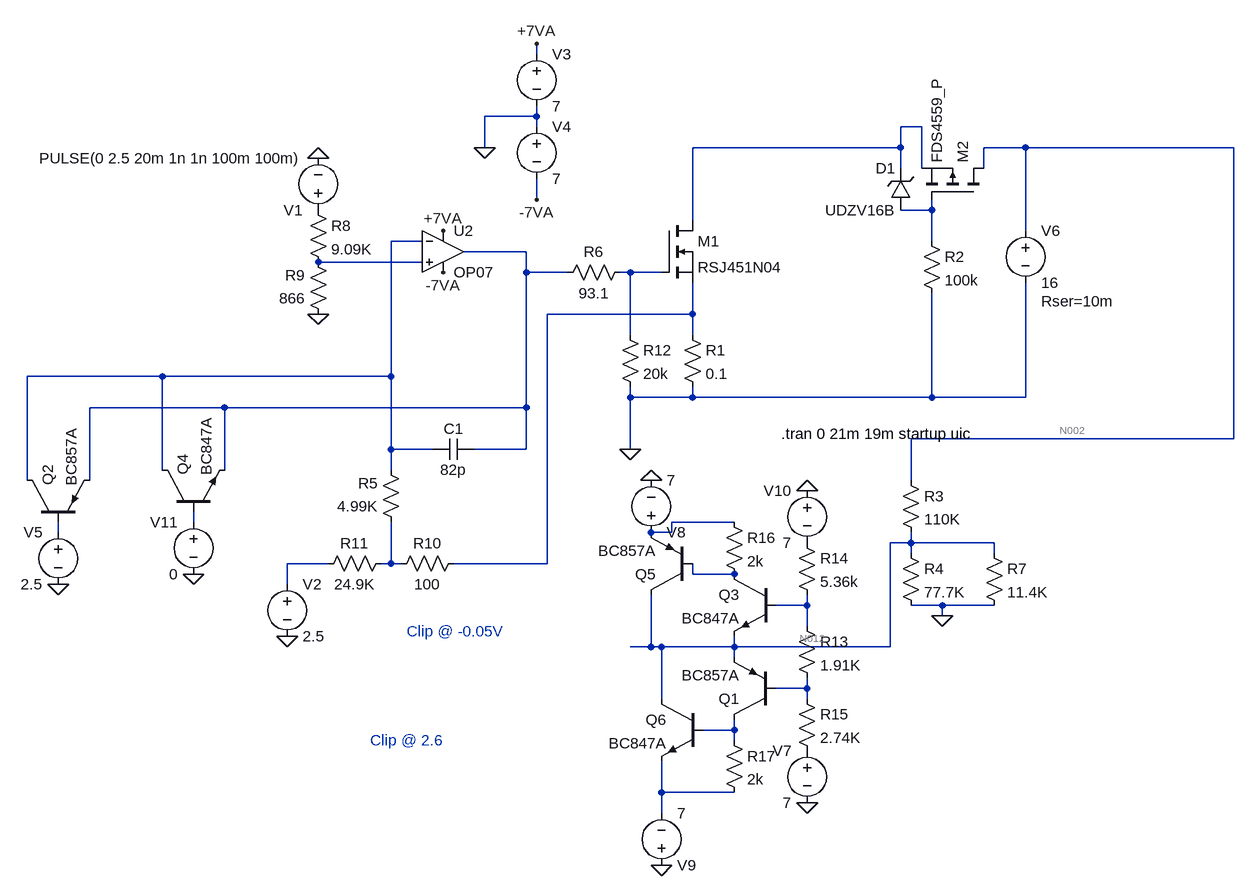
[diagram p0: schematic SIM_WITH_LOAD.asc]
SIM_WITH_LOAD.asc, the LTspice schematic file:
Version 4
SHEET 1 1792 1140
WIRE -272 -128 -272 -144
WIRE -272 -32 -272 -48
WIRE -272 -32 -352 -32
WIRE -272 -16 -272 -32
WIRE 320 -16 288 -16
WIRE -352 16 -352 -32
WIRE 288 16 288 -16
WIRE 288 16 -32 16
WIRE 480 16 416 16
WIRE 800 16 480 16
WIRE 288 48 288 16
WIRE 320 48 320 -16
WIRE 416 48 416 16
WIRE -272 96 -272 64
WIRE 336 112 336 96
WIRE 336 112 288 112
WIRE -32 128 -32 16
WIRE 480 144 480 16
WIRE -448 160 -496 160
WIRE 336 160 336 112
WIRE -288 176 -384 176
WIRE -448 192 -608 192
WIRE -288 208 -288 176
WIRE -224 208 -288 208
WIRE -128 208 -144 208
WIRE -80 208 -128 208
WIRE -32 272 -32 224
WIRE -32 272 -256 272
WIRE -128 304 -128 208
WIRE -32 304 -32 272
WIRE -848 368 -1056 368
WIRE -496 368 -496 160
WIRE -496 368 -848 368
WIRE -128 400 -128 384
WIRE -32 400 -32 384
WIRE -32 400 -128 400
WIRE 336 400 336 240
WIRE 336 400 -32 400
WIRE 480 400 480 224
WIRE 480 400 336 400
WIRE -752 416 -960 416
WIRE -288 416 -288 208
WIRE -288 416 -752 416
WIRE 800 464 800 16
WIRE 800 464 304 464
WIRE -496 480 -496 368
WIRE -432 480 -496 480
WIRE -288 480 -288 416
WIRE -288 480 -368 480
WIRE -128 480 -128 400
WIRE -848 512 -848 368
WIRE -752 512 -752 416
WIRE -496 512 -496 480
WIRE -1056 528 -1056 368
WIRE -960 528 -960 416
WIRE 304 528 304 464
WIRE -800 592 -800 576
WIRE 32 592 -64 592
WIRE -1008 608 -1008 592
WIRE -64 608 -64 592
WIRE -64 608 -96 608
WIRE 304 624 304 608
WIRE 304 624 272 624
WIRE 432 624 304 624
WIRE 304 640 304 624
WIRE 432 640 432 624
WIRE -592 656 -656 656
WIRE -496 656 -496 592
WIRE -496 656 -512 656
WIRE -480 656 -496 656
WIRE -256 656 -256 272
WIRE -256 656 -400 656
WIRE -32 672 -32 656
WIRE 32 672 -32 672
WIRE -656 688 -656 656
WIRE 144 720 144 704
WIRE 144 720 96 720
WIRE 352 720 304 720
WIRE 432 720 352 720
WIRE 352 736 352 720
WIRE 144 752 144 720
WIRE -96 784 -96 704
WIRE -96 784 -128 784
WIRE -80 784 -96 784
WIRE 32 784 32 768
WIRE 32 784 -80 784
WIRE 272 784 272 624
WIRE 272 784 32 784
WIRE 32 800 32 784
WIRE 144 848 144 832
WIRE 144 848 96 848
WIRE -80 864 -80 784
WIRE 144 864 144 848
WIRE 32 912 32 896
WIRE 32 912 -16 912
WIRE 32 928 32 912
WIRE -80 1008 -80 960
WIRE 32 1008 -80 1008
WIRE -80 1040 -80 1008
FLAG -352 16 0
FLAG 352 736 0
FLAG -96 528 0
FLAG -608 32 0
FLAG -656 768 0
FLAG -608 272 0
FLAG -272 -144 +7VA
FLAG -272 96 -7VA
FLAG -416 144 +7VA
FLAG -416 208 -7VA
FLAG -1008 688 0
FLAG -800 672 0
FLAG -128 480 0
FLAG 144 1024 0
FLAG -80 1120 0
FLAG 144 544 0
SYMBOL nmos -80 128 R0
SYMATTR InstName M1
SYMATTR Value RSJ451N04
SYMBOL res -48 288 R0
SYMATTR InstName R1
SYMATTR Value 0.1
SYMBOL voltage -272 -144 R0
WINDOW 123 0 0 Left 2
WINDOW 39 0 0 Left 2
SYMATTR InstName V3
SYMATTR Value 7
SYMBOL voltage -272 -32 R0
WINDOW 123 0 0 Left 2
WINDOW 39 0 0 Left 2
SYMATTR InstName V4
SYMATTR Value 7
SYMBOL zener 304 112 R180
WINDOW 0 24 64 Left 2
WINDOW 3 24 0 Left 2
SYMATTR InstName D1
SYMATTR Value UDZV16B
SYMATTR Description Diode
SYMATTR Type diode
SYMBOL res 320 144 R0
SYMATTR InstName R2
SYMATTR Value 100k
SYMBOL pmos 416 96 M270
SYMATTR InstName M2
SYMATTR Value FDS4559_P
SYMBOL res 288 512 R0
SYMATTR InstName R3
SYMATTR Value 110K
SYMBOL res 288 624 R0
SYMATTR InstName R4
SYMATTR Value 77.7K
SYMBOL pnp 96 896 R180
SYMATTR InstName Q1
SYMATTR Value BC857A
SYMBOL npn 96 672 M0
SYMATTR InstName Q3
SYMATTR Value BC847A
SYMBOL voltage -96 624 M180
WINDOW 123 0 0 Left 2
WINDOW 39 0 0 Left 2
SYMATTR InstName V8
SYMATTR Value 7
SYMBOL voltage 480 128 R0
WINDOW 123 0 0 Left 2
WINDOW 39 24 124 Left 2
SYMATTR SpiceLine Rser=10m
SYMATTR InstName V6
SYMATTR Value 16
SYMBOL res -128 192 R90
WINDOW 0 0 56 VBottom 2
WINDOW 3 32 56 VTop 2
SYMATTR InstName R6
SYMATTR Value 93.1
SYMBOL cap -368 464 R90
WINDOW 0 0 32 VBottom 2
WINDOW 3 32 32 VTop 2
SYMATTR InstName C1
SYMATTR Value 82p
SYMBOL voltage -608 128 R180
WINDOW 123 0 0 Left 2
WINDOW 39 0 0 Left 2
SYMATTR InstName V1
SYMATTR Value PULSE(0 2.5 20m 1n 1n 100m 100m)
SYMBOL res -624 96 R0
SYMATTR InstName R8
SYMATTR Value 9.09K
SYMBOL res -592 288 R180
WINDOW 0 36 76 Left 2
WINDOW 3 36 40 Left 2
SYMATTR InstName R9
SYMATTR Value 866
SYMBOL voltage -656 672 R0
WINDOW 123 0 0 Left 2
WINDOW 39 0 0 Left 2
SYMATTR InstName V2
SYMATTR Value 2.5
SYMBOL res -384 640 R90
WINDOW 0 0 56 VBottom 2
WINDOW 3 32 56 VTop 2
SYMATTR InstName R10
SYMATTR Value 100
SYMBOL res -496 640 R90
WINDOW 0 0 56 VBottom 2
WINDOW 3 32 56 VTop 2
SYMATTR InstName R11
SYMATTR Value 24.9K
SYMBOL res -144 288 R0
SYMATTR InstName R12
SYMATTR Value 20k
SYMBOL res -480 608 R180
WINDOW 0 36 76 Left 2
WINDOW 3 36 40 Left 2
SYMATTR InstName R5
SYMATTR Value 4.99K
SYMBOL pnp -1056 592 R270
SYMATTR InstName Q2
SYMATTR Value BC857A
SYMBOL voltage -1008 592 M0
WINDOW 123 0 0 Left 2
WINDOW 39 0 0 Left 2
SYMATTR InstName V5
SYMATTR Value 2.5
SYMBOL npn -848 576 R270
SYMATTR InstName Q4
SYMATTR Value BC847A
SYMBOL voltage -800 576 M0
WINDOW 123 0 0 Left 2
WINDOW 39 0 0 Left 2
SYMATTR InstName V11
SYMATTR Value 0
SYMBOL res 128 736 R0
SYMATTR InstName R13
SYMATTR Value 1.91K
SYMBOL res 128 608 R0
SYMATTR InstName R14
SYMATTR Value 5.36k
SYMBOL res 128 848 R0
SYMATTR InstName R15
SYMATTR Value 2.74K
SYMBOL voltage 144 928 M0
WINDOW 123 0 0 Left 2
WINDOW 39 0 0 Left 2
SYMATTR InstName V7
SYMATTR Value 7
SYMBOL voltage -80 1136 M180
WINDOW 123 0 0 Left 2
WINDOW 39 0 0 Left 2
SYMATTR InstName V9
SYMATTR Value 7
SYMBOL voltage 144 528 M0
WINDOW 123 0 0 Left 2
WINDOW 39 0 0 Left 2
SYMATTR InstName V10
SYMATTR Value 7
SYMBOL pnp -32 704 R180
SYMATTR InstName Q5
SYMATTR Value BC857A
SYMBOL npn -16 864 M0
SYMATTR InstName Q6
SYMATTR Value BC847A
SYMBOL res 16 576 R0
SYMATTR InstName R16
SYMATTR Value 2k
SYMBOL res 16 912 R0
SYMATTR InstName R17
SYMATTR Value 2k
SYMBOL res 416 624 R0
SYMATTR InstName R7
SYMATTR Value 11.4K
SYMBOL Opamps\\OP07 -416 112 R0
SYMATTR InstName U2
TEXT 104 456 Left 2 !.tran 0 21m 19m startup uic
TEXT -472 760 Left 2 ;Clip @ -0.05V
TEXT -528 928 Left 2 ;Clip @ 2.6

The netlist it stands for:
* SIM_WITH_LOAD.asc
M1 N001 N007 N008 N008 RSJ451N04
R1 N008 0 0.1
V3 +7VA 0 7
V4 0 -7VA 7
D1 N003 N001 UDZV16B
R2 N003 0 100k
M2 N002 N003 N001 N001 FDS4559_P
R3 N002 N012 110K
R4 N012 0 77.7K
Q1 N018 N017 N012 0 BC857A
Q3 N015 N016 N012 0 BC847A
V8 N010 0 7
V6 N002 0 16 Rser=10m
R6 N007 N005 93.1
C1 N005 N004 82p
V1 P001 0 PULSE(0 2.5 20m 1n 1n 100m 100m)
R8 P001 N006 9.09K
R9 0 N006 866
V2 N013 0 2.5
R10 N008 N014 100
R11 N014 N013 24.9K
R12 N007 0 20k
R5 N014 N004 4.99K
Q2 N004 N011 N005 0 BC857A
V5 N011 0 2.5
Q4 N004 N009 N005 0 BC847A
V11 N009 0 0
R13 N016 N017 1.91K
R14 P002 N016 5.36k
R15 N017 P003 2.74K
V7 P003 0 7
V9 0 N019 7
V10 0 P002 7
Q5 N012 N015 N010 0 BC857A
Q6 N012 N018 N019 0 BC847A
R16 N010 N015 2k
R17 N018 N019 2k
R7 N012 0 11.4K
XU2 N006 N004 +7VA -7VA N005 LT1001  ; OP07, pins In+ In- V+ V- OUT
.model D D
.lib standard.dio
.model NPN NPN
.model PNP PNP
.lib standard.bjt
.model NMOS NMOS
.model PMOS PMOS
.lib standard.mos
.tran 0 21m 19m startup uic
* Clip @ -0.05V
* Clip @ 2.6
.lib LTC.lib
.backanno
.end

* Results of the author's LTspice run, read from the files saved beside the schematic
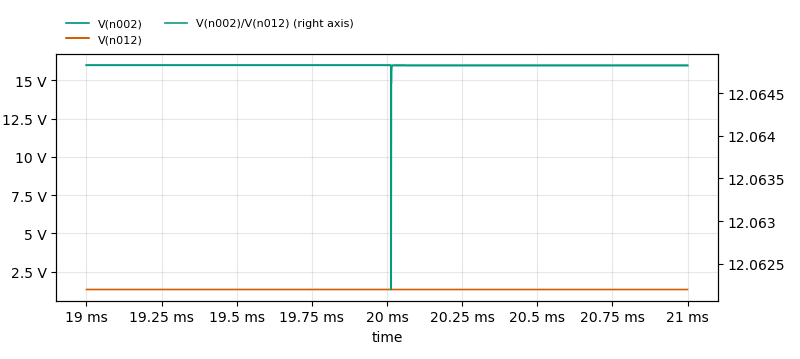
[diagram p1: Transient Analysis of SIM_WITH_LOAD.asc, plotted from the saved traces]
* Transient Analysis, 1 run:
*   V(n002): min 15.98 V, max 16 V, average 15.99 V, rms 15.99 V, last 15.98 V
*   V(n012): min 1.324 V, max 1.326 V, average 1.325 V, rms 1.325 V, last 1.324 V
*   V(n002)/V(n012): min 12.06 , max 12.06 , average 12.06 , rms 12.06 , last 12.06 